# Altium schematic sheet Power-Input.SchDoc
size A; SheetNumber: 2; SheetTotal: 12
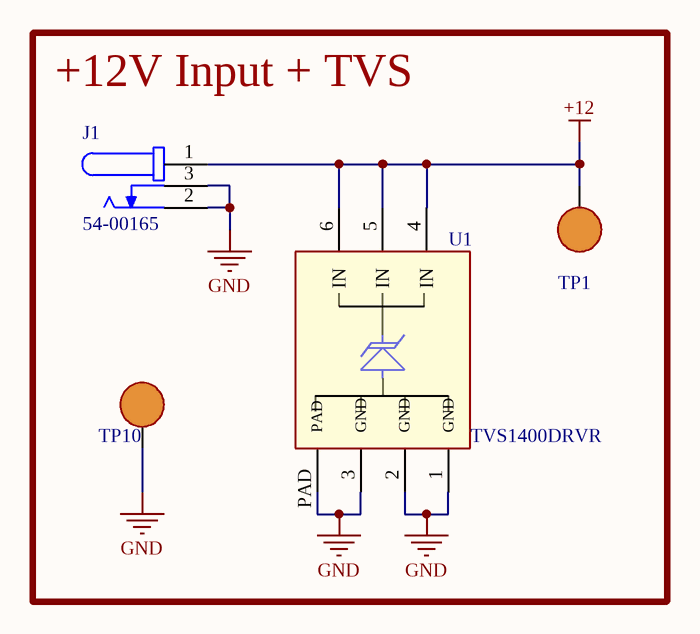
[diagram p0: Power-Input.SchDoc]

## Parts
J1  54-00165  [TENSILITY_54-00165]
TP1  RCWCTE  [RCWCTE]  (value not drawn)
TP10  RCWCTE  [RCWCTE]  (value not drawn)
U1  TVS1400DRVR  [6-WDFN-EP]

## Blocks framed on the sheet
+12V Input + TVS: J1 TP1 TP10 U1

## Nets
+12: J1.1(A) TP1.1 U1.4(IN) U1.5(IN) U1.6(IN)
GND: J1.2 J1.3 TP10.1 U1.1(GND) U1.2(GND) U1.3(GND) U1.PAD

## Library data of the parts
J1 = BARREL JACK 2.5MM ID 5.5MM OD: Connector, dc jack 5.5x2.5 mm, PCB mount, 90 degrees, silver plated, PA9T, SMT; MFR: Same Sky; MFR PN: PJ-002BH-SMT-TR; Type: SMD
TP1 TP10 = TEST POINT: Test Point, Surface Mount; MFR: KOA Speer Electronics, Inc.; MFR PN: RCWCTE; Type: SMD
U1 = TVS1400DRVR: UNIDIR  PRECISION SURGE DIODE; MFR: Texas Instruments; MFR PN: TVS1400DRVR; Value: *; Type: SMD